# EAGLE schematic ECAM01 (EAGLE 7.3.0)
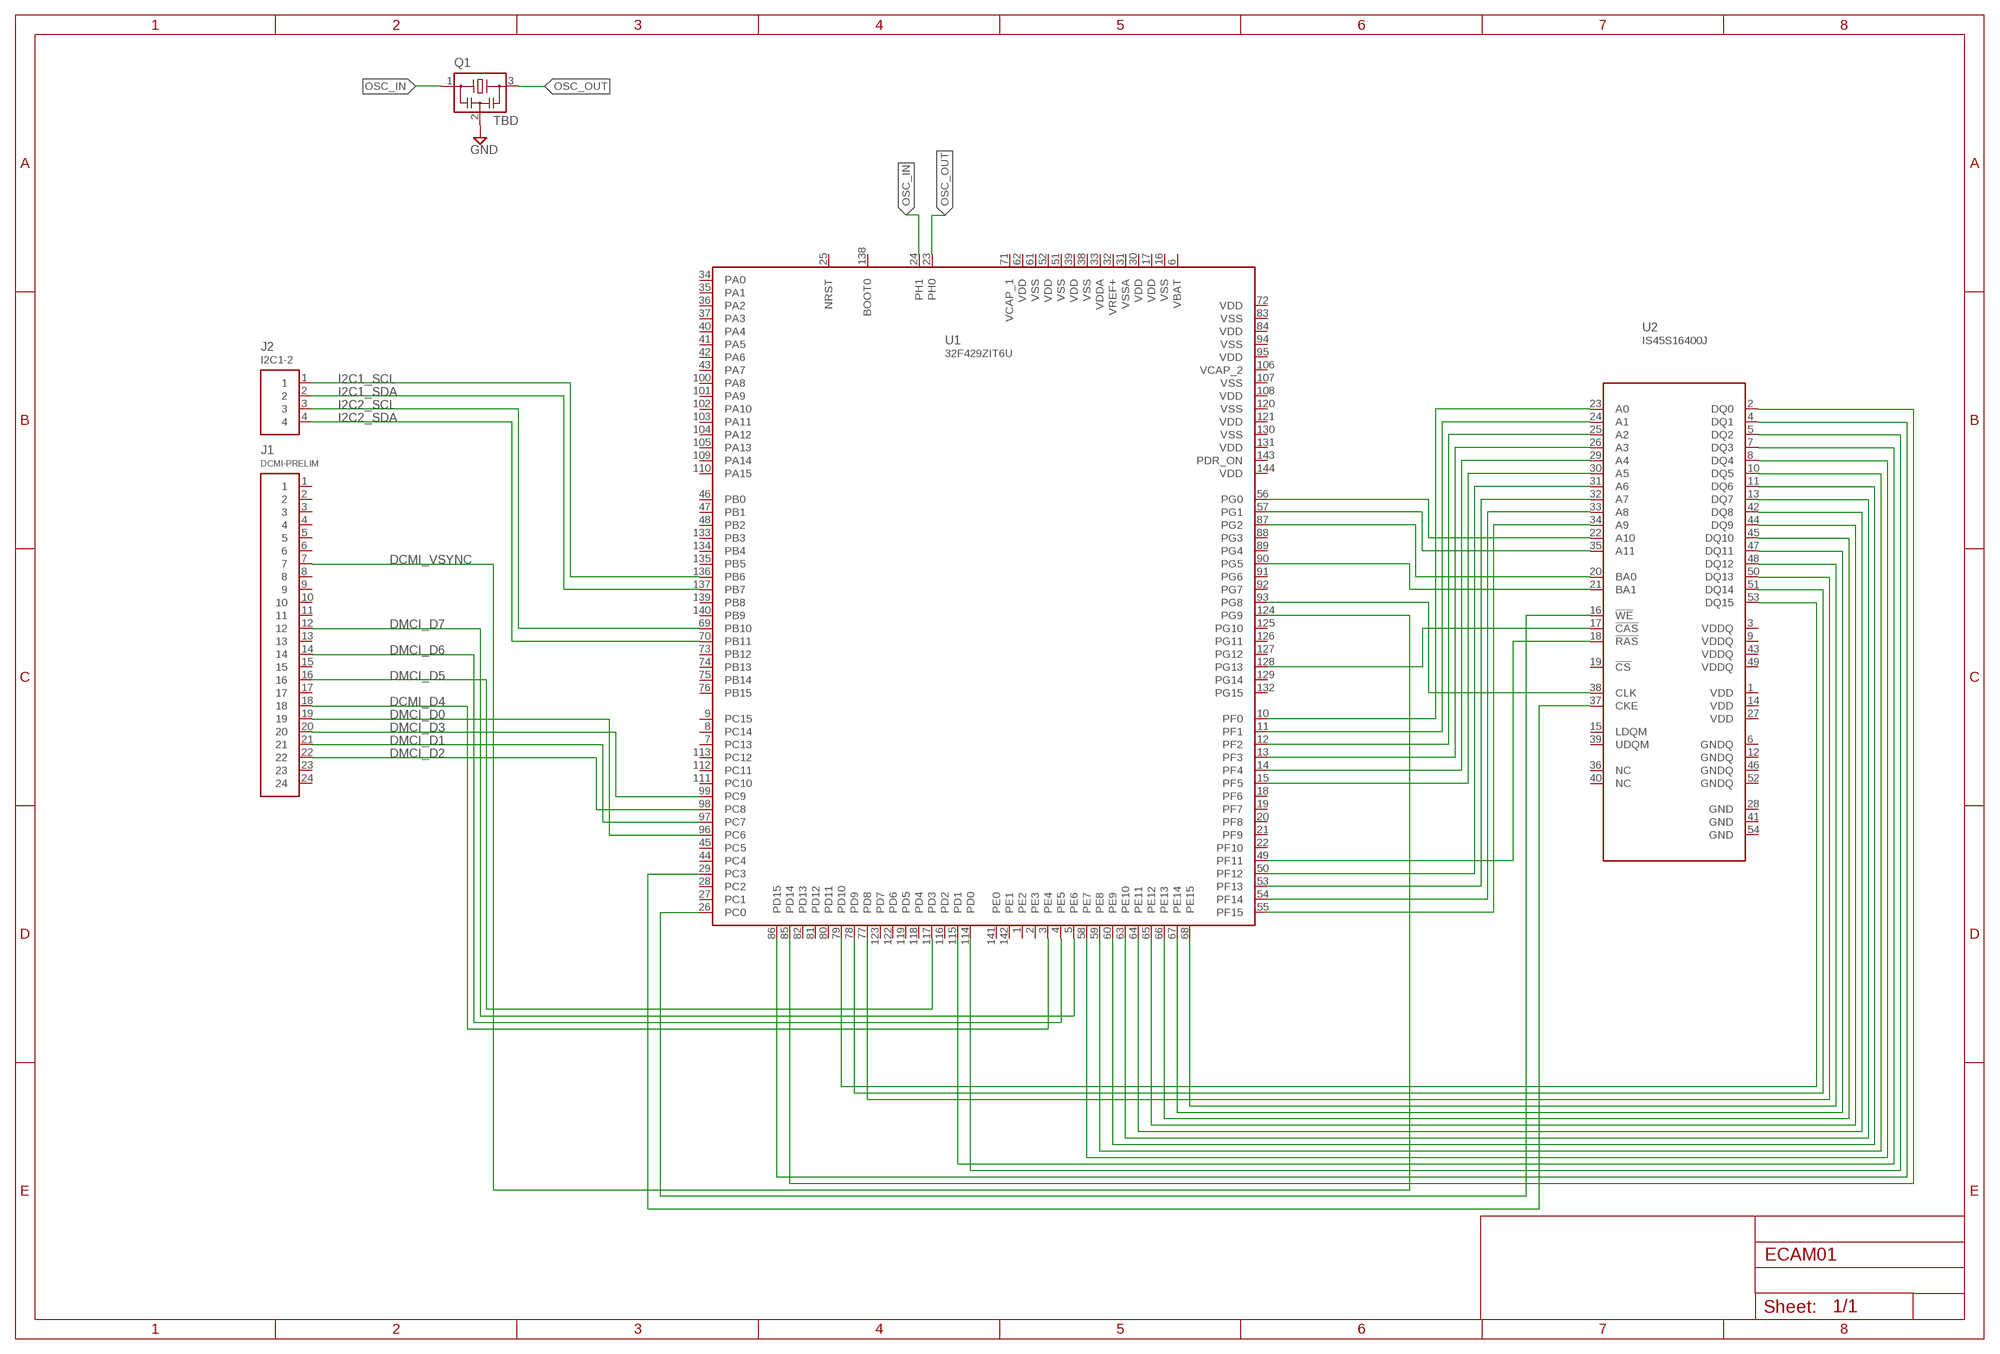
[diagram p0: schematic, sheet 1]

## Parts
J1  DCMI-PRELIM  [CON-DCMI-PRELIM]
J2  I2C1-2  CPL-CON-HEADER-0.1IN-4P-M  [CON-HDR-4POS-MALE]
Q1  TBD  CSTCR6M00G53Z  [CSTCR6M]
U1  32F429ZIT6U  [LQFP144]
U2  IS45S16400J  [54-TSOP]

## Nets
DCMI_D4: J1.18 U1.3(PE4)
DCMI_VSYNC: J1.7 U1.124(PG9)
DMCI_D0: J1.19 U1.96(PC6)
DMCI_D1: J1.21 U1.97(PC7)
DMCI_D2: J1.22 U1.98(PC8)
DMCI_D3: J1.20 U1.99(PC9)
DMCI_D5: J1.16 U1.117(PD3)
DMCI_D6: J1.14 U1.4(PE5)
DMCI_D7: J1.12 U1.5(PE6)
GND: Q1.2
I2C1_SCL: J2.1 U1.136(PB6)
I2C1_SDA: J2.2 U1.137(PB7)
I2C2_SCL: J2.3 U1.69(PB10)
I2C2_SDA: J2.4 U1.70(PB11)
N$1: U1.10(PF0) U2.23(A0)
N$2: U1.11(PF1) U2.24(A1)
N$3: U1.12(PF2) U2.25(A2)
N$4: U1.13(PF3) U2.26(A3)
N$5: U1.14(PF4) U2.29(A4)
N$6: U1.15(PF5) U2.30(A5)
N$7: U1.26(PC0) U2.16(!WE)
N$8: U1.29(PC3) U2.37(CKE)
N$9: U1.49(PF11) U2.18(!RAS)
N$10: U1.50(PF12) U2.31(A6)
N$11: U1.53(PF13) U2.32(A7)
N$12: U1.54(PF14) U2.33(A8)
N$13: U1.55(PF15) U2.34(A9)
N$14: U1.56(PG0) U2.22(A10)
N$15: U1.57(PG1) U2.35(A11)
N$16: U1.58(PE7) U2.8(DQ4)
N$17: U1.59(PE8) U2.10(DQ5)
N$18: U1.60(PE9) U2.11(DQ6)
N$19: U1.63(PE10) U2.13(DQ7)
N$20: U1.64(PE11) U2.42(DQ8)
N$21: U1.65(PE12) U2.44(DQ9)
N$22: U1.86(PD15) U2.4(DQ1)
N$23: U1.66(PE13) U2.45(DQ10)
N$24: U1.67(PE14) U2.47(DQ11)
N$25: U1.68(PE15) U2.48(DQ12)
N$26: U1.77(PD8) U2.50(DQ13)
N$27: U1.78(PD9) U2.51(DQ14)
N$28: U1.79(PD10) U2.53(DQ15)
N$29: U1.85(PD14) U2.2(DQ0)
N$30: U1.87(PG2) U2.20(BA0)
N$31: U1.90(PG5) U2.21(BA1)
N$32: U1.93(PG8) U2.38(CLK)
N$33: U1.114(PD0) U2.5(DQ2)
N$34: U1.115(PD1) U2.7(DQ3)
N$35: U1.128(PG13) U2.17(!CAS)
OSC_IN: Q1.1 U1.24(PH1)
OSC_OUT: Q1.3 U1.23(PH0)
Unconnected: J1.1 J1.2 J1.3 J1.4 J1.5 J1.6 J1.8 J1.9 J1.10 J1.11 J1.13 J1.15 J1.17 J1.23 J1.24 U1.1(PE2) U1.2(PE3) U1.7(PC13) U1.8(PC14) U1.9(PC15) U1.18(PF6) U1.19(PF7) U1.20(PF8) U1.21(PF9) U1.22(PF10) U1.25(NRST) U1.27(PC1) U1.28(PC2) U1.34(PA0) U1.35(PA1) U1.36(PA2) U1.37(PA3) U1.40(PA4) U1.41(PA5) U1.42(PA6) U1.43(PA7) U1.44(PC4) U1.45(PC5) U1.46(PB0) U1.47(PB1) U1.48(PB2) U1.73(PB12) U1.74(PB13) U1.75(PB14) U1.76(PB15) U1.80(PD11) U1.81(PD12) U1.82(PD13) U1.88(PG3) U1.89(PG4) U1.91(PG6) U1.92(PG7) U1.100(PA8) U1.101(PA9) U1.102(PA10) U1.103(PA11) U1.104(PA12) U1.105(PA13) U1.109(PA14) U1.110(PA15) U1.111(PC10) U1.112(PC11) U1.113(PC12) U1.116(PD2) U1.118(PD4) U1.119(PD5) U1.122(PD6) U1.123(PD7) U1.125(PG10) U1.126(PG11) U1.127(PG12) U1.129(PG14) U1.132(PG15) U1.133(PB3) U1.134(PB4) U1.135(PB5) U1.138(BOOT0) U1.139(PB8) U1.140(PB9) U1.141(PE0) U1.142(PE1) U2.15(LDQM) U2.19(!CS) U2.36(NC) U2.39(UDQM) U2.40(NC)

## Power pins joined to a net without a drawn wire
GND: U2.28(GND) U2.41(GND) U2.54(GND)
GNDQ: U2.6(GNDQ) U2.12(GNDQ) U2.46(GNDQ) U2.52(GNDQ)
PDR_ON: U1.143(PDR_ON)
VBAT: U1.6(VBAT)
VCAP_1: U1.71(VCAP_1)
VCAP_2: U1.106(VCAP_2)
VDD: U1.17(VDD) U1.30(VDD) U1.39(VDD) U1.52(VDD) U1.62(VDD) U1.72(VDD) U1.84(VDD) U1.95(VDD) U1.108(VDD) U1.121(VDD) U1.131(VDD) U1.144(VDD) U2.1(VDD) U2.14(VDD) U2.27(VDD)
VDDA: U1.33(VDDA)
VDDQ: U2.3(VDDQ) U2.9(VDDQ) U2.43(VDDQ) U2.49(VDDQ)
VREF+: U1.32(VREF+)
VSS: U1.16(VSS) U1.38(VSS) U1.51(VSS) U1.61(VSS) U1.83(VSS) U1.94(VSS) U1.107(VSS) U1.120(VSS) U1.130(VSS)
VSSA: U1.31(VSSA)

## Library data of the parts
J1 = TinWhiskers:DCMI-PRELIM: Connector: Dig. Camera Interface (DCMI), 24-pin;
J2 = TinWhiskers:CPL-CON-HEADER-0.1IN-4P-M
Q1 = TinWhiskers:CSTCR: Resonator Source: murata.co.jp; MPN: CSTCR6M00G53-R0; OC_FARNELL: 1170434; OC_NEWARK: 25M8759
U1 = TinWhiskers:32F429ZIT6U: STMicroelectronics CPU chip
U2 = TinWhiskers:IS45S16400J: IS45S16400J (SDRAM; Mfr: ISSI); Specs: http://www.issi.com/WW/pdf/42-45S16400J.pdf